# EAGLE schematic SensorTensao (EAGLE 6.1)
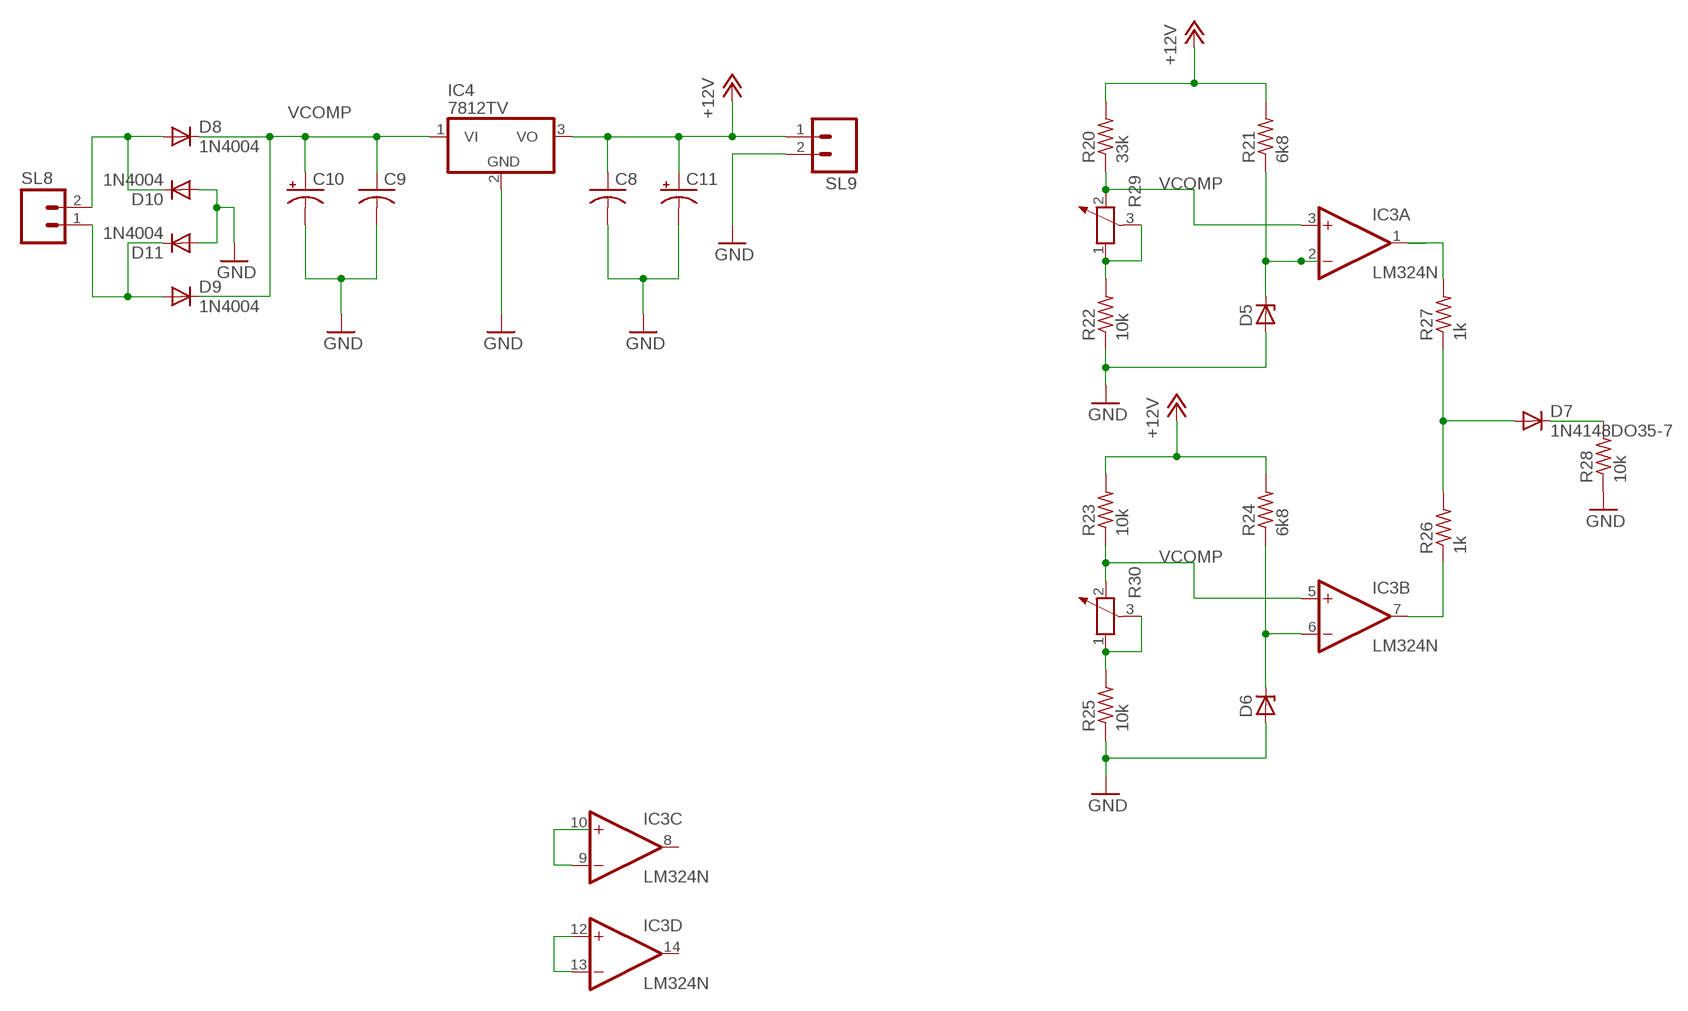
[diagram p0: schematic, sheet 1]

## Parts
C8  C-US050-030X075  [C050-030X075]
C9  C-US050-030X075  [C050-030X075]
C10  CPOL-USE2.5-6  [E2,5-6]
C11  CPOL-USE2.5-6  [E2,5-6]
D5  ZENER-DIODEZD-7.5  [ZDIO-7.5]
D6  ZENER-DIODEZD-7.5  [ZDIO-7.5]
D7  1N4148DO35-7  [DO35-7]
D8  1N4004  [DO41-10]
D9  1N4004  [DO41-10]
D10  1N4004  [DO41-10]
D11  1N4004  [DO41-10]
IC3  LM324N  [DIL14]
IC4  7812TV  [TO220V]
R20  33k  R-US_0204/7  [0204/7]
R21  6k8  R-US_0204/7  [0204/7]
R22  10k  R-US_0204/7  [0204/7]
R23  10k  R-US_0204/7  [0204/7]
R24  6k8  R-US_0204/7  [0204/7]
R25  10k  R-US_0204/7  [0204/7]
R26  1k  R-US_0204/7  [0204/7]
R27  1k  R-US_0204/7  [0204/7]
R28  10k  R-US_0204/7  [0204/7]
R29  POTENTIOMETER_PT-10S  [PT-10S]
R30  POTENTIOMETER_PT-10S  [PT-10S]
SL8  M02  [02P]
SL9  M02  [02P]

## Nets
+12V: C8.1 C11.+ IC4.3(VO) R20.2 R21.2 R23.2 R24.2 SL9.1
GND: C8.2 C9.2 C10.- C11.- D5.A D6.A D10.A D11.A IC4.2(GND) R22.1 R25.1 R28.1 SL9.2
N$16: R25.2 R30.1 R30.3
N$19: R22.2 R29.1 R29.3
N$22: D5.C IC3.2(A:-IN) R21.1
N$24: D6.C IC3.6(B:-IN) R24.1
N$26: IC3.7(B:OUT) R26.1
N$27: IC3.1(A:OUT) R27.2
N$28: D7.A R26.2 R27.1
N$29: IC3.9(C:-IN)
N$30: IC3.12(D:+IN) IC3.13(D:-IN)
N$32: D8.A D10.C SL8.2
N$33: D9.A D11.C SL8.1
SUBSOBRETENSAO: D7.C R28.2
VCOMP: C9.1 C10.+ D8.C D9.C IC3.3(A:+IN) IC3.5(B:+IN) IC4.1(VI) R20.1 R23.1 R29.2 R30.2
Unconnected: IC3.8(C:OUT) IC3.10(C:+IN) IC3.14(D:OUT)

## Power pins joined to a net without a drawn wire
V+: IC3.4(P:V+)
V-: IC3.11(P:V-)

## Library data of the parts
C8 C9 = rcl:C-US: CAPACITOR, American symbol
C10 C11 = rcl:CPOL-US: POLARIZED CAPACITOR, American symbol
D5 D6 = diode:ZENER-DIODE: Z-Diode
D7 = diode:1N4148: DIODE high speed (Philips)
D8-D11 = diode:1N4004: DIODE general purpose rectifier, 1 A
IC3 = linear:LM324: OP AMP
IC4 = linear:78*: Positive VOLTAGE REGULATOR Source: http://cache.national.com/ds/LM/LM78L05.pdf http://www.fairchildsemi.com/ds/LM/LM7805.pdf
R20-R28 = rcl:R-US_: RESISTOR, American symbol
R29 R30 = rcl:POTENTIOMETER_: Potentiometer
SL8 SL9 = con-amp-quick:M02: AMP QUICK CONNECTOR; OC_FARNELL: unknown; OC_NEWARK: unknown